# EAGLE design hvreg_feedback_3PS_ACDC (EAGLE 7.2.0)
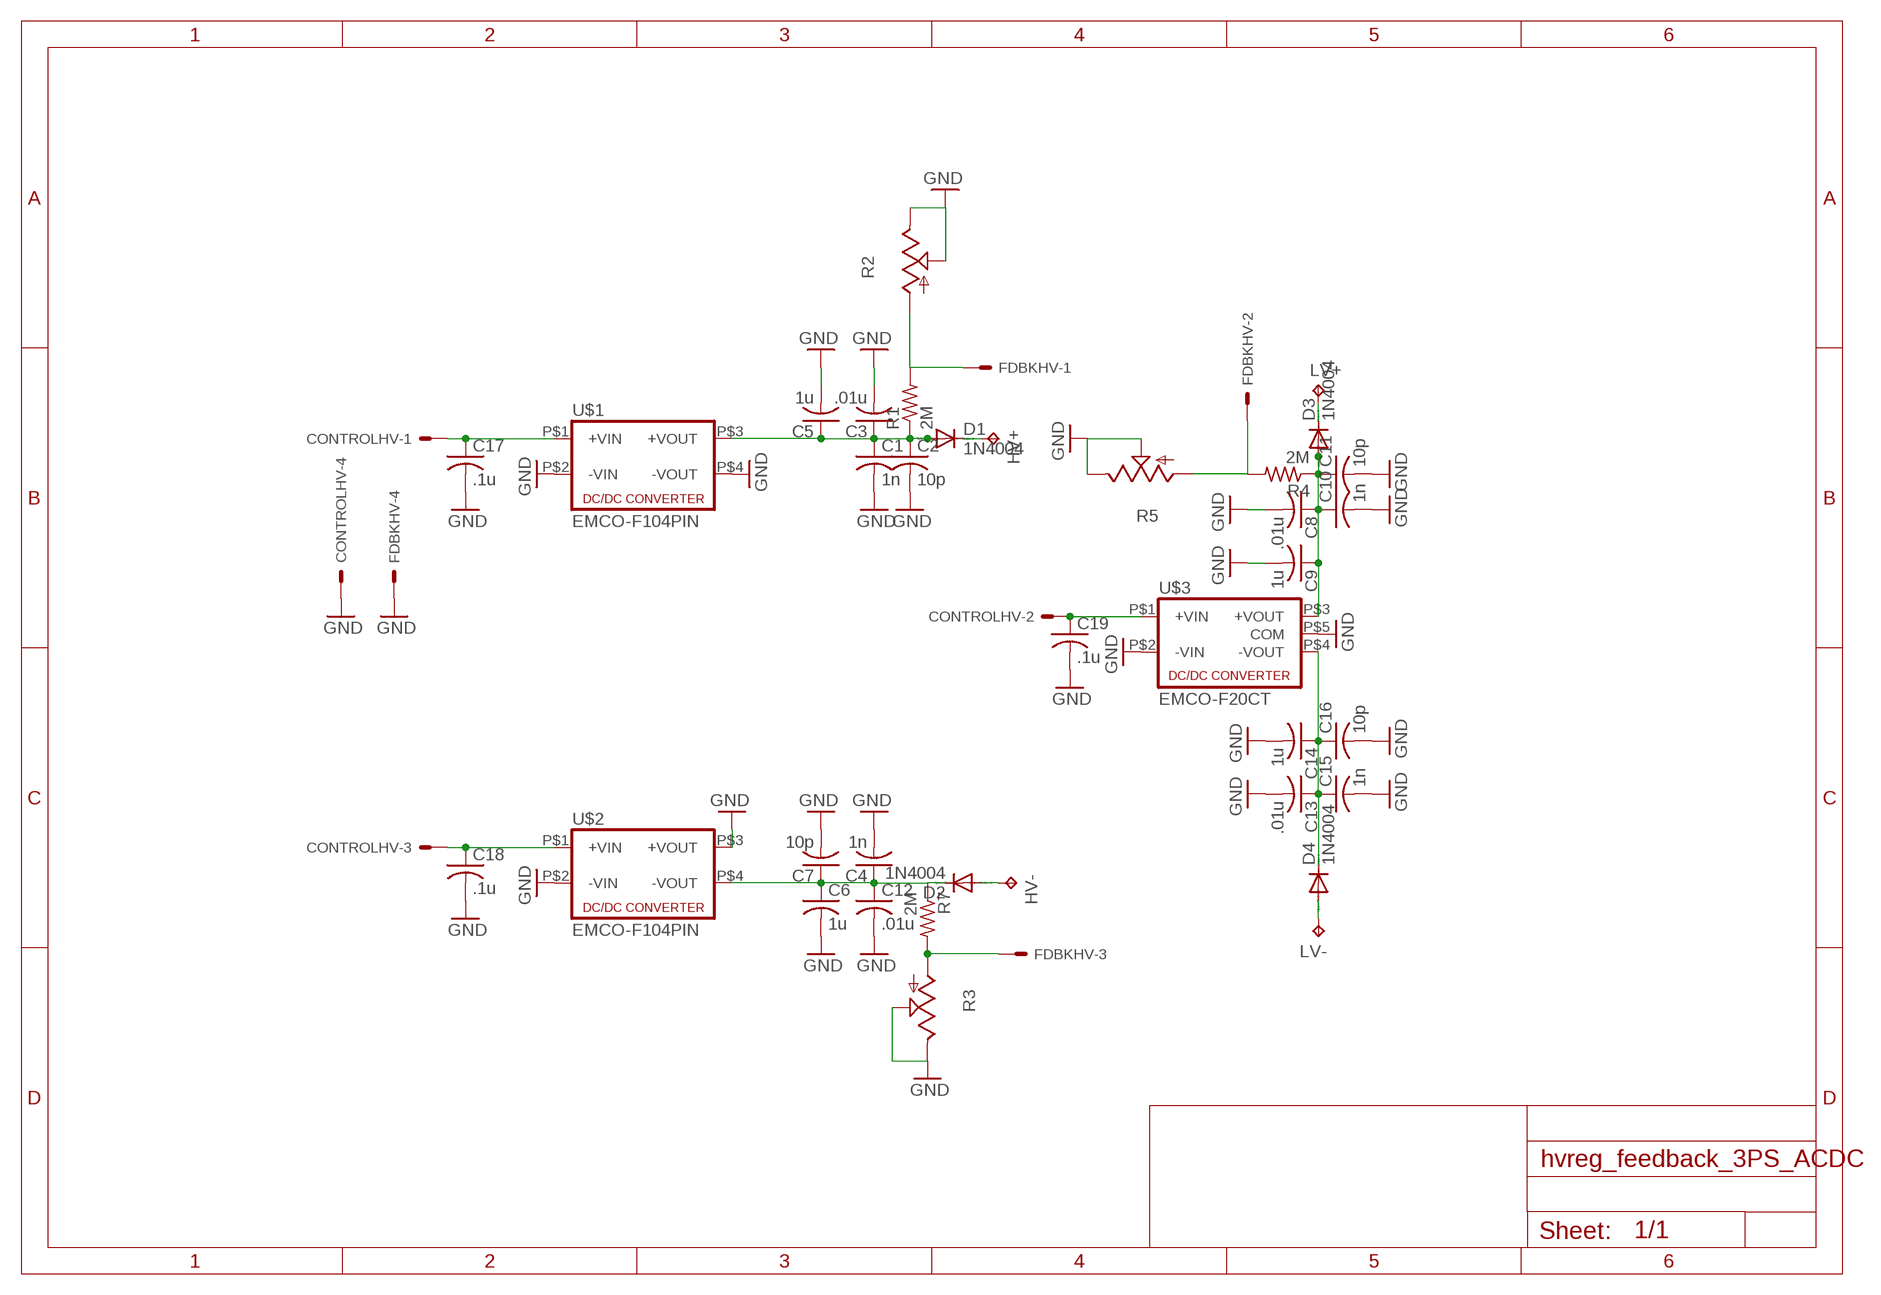
[diagram p0: schematic, sheet 1]

## Parts
C1  1n  C-US102-043X133  [C102-043X133]
C2  10p  C-US102-043X133  [C102-043X133]
C3  .01u  C-US102-043X133  [C102-043X133]
C4  1n  C-US102-043X133  [C102-043X133]
C5  1u  C-US275-205X316  [C275-205X316]
C6  1u  C-US275-205X316  [C275-205X316]
C7  10p  C-US102-043X133  [C102-043X133]
C8  .01u  C-US102-043X133  [C102-043X133]
C9  1u  C-US275-205X316  [C275-205X316]
C10  1n  C-US102-043X133  [C102-043X133]
C11  10p  C-US102-043X133  [C102-043X133]
C12  .01u  C-US102-043X133  [C102-043X133]
C13  .01u  C-US102-043X133  [C102-043X133]
C14  1u  C-US275-205X316  [C275-205X316]
C15  1n  C-US102-043X133  [C102-043X133]
C16  10p  C-US102-043X133  [C102-043X133]
C17  .1u  C-US102-043X133  [C102-043X133]
C18  .1u  C-US102-043X133  [C102-043X133]
C19  .1u  C-US102-043X133  [C102-043X133]
CONTROLHV  KK-156-4  [KK-156-4]
D1  1N4004  [DO41-10]
D2  1N4004  [DO41-10]
D3  1N4004  [DO41-10]
D4  1N4004  [DO41-10]
FDBKHV  KK-156-4  [KK-156-4]
HV+  TPPAD1-20Y  [P1-20Y]
HV-  TPPAD1-20Y  [P1-20Y]
LV+  TPPAD1-20Y  [P1-20Y]
LV-  TPPAD1-20Y  [P1-20Y]
R1  2M  R-US_0613/15  [P0613/15]
R2  TRIM_US-B90P  [SP19L]
R3  TRIM_US-B90P  [SP19L]
R4  2M  R-US_0613/15  [P0613/15]
R5  TRIM_US-B90P  [SP19L]
R7  2M  R-US_0613/15  [P0613/15]
U$1  EMCO-F104PIN  [EMCO-F]
U$2  EMCO-F104PIN  [EMCO-F]
U$3  EMCO-F20CT  [EMCO-F*CT]

## Nets
GND: C1.2 C2.2 C3.2 C4.2 C5.2 C6.2 C7.2 C8.2 C9.2 C10.2 C11.2 C12.2 C13.2 C14.2 C15.2 C16.2 C17.2 C18.2 C19.2 CONTROLHV.4 FDBKHV.4 R2.E R2.S R3.E R3.S R5.E R5.S U$1.P$2(-VIN) U$1.P$4(-VOUT) U$2.P$2(-VIN) U$2.P$3(+VOUT) U$3.P$2(-VIN) U$3.P$5(COM)
N$1: C1.1 C2.1 C3.1 C5.1 D1.A R1.1 U$1.P$3(+VOUT)
N$2: C4.1 C6.1 C7.1 C12.1 D2.C R7.1 U$2.P$4(-VOUT)
N$3: FDBKHV.1 R1.2 R2.A
N$4: D2.A HV-.TP
N$5: C8.1 C9.1 C10.1 C11.1 D3.A R4.1 U$3.P$3(+VOUT)
N$6: D1.C HV+.TP
N$7: FDBKHV.2 R4.2 R5.A
N$8: FDBKHV.3 R3.A R7.2
N$9: D3.C LV+.TP
N$10: C13.1 C14.1 C15.1 C16.1 D4.C U$3.P$4(-VOUT)
N$12: D4.A LV-.TP
N$13: C17.1 CONTROLHV.1 U$1.P$1(+VIN)
N$14: C19.1 CONTROLHV.2 U$3.P$1(+VIN)
N$15: C18.1 CONTROLHV.3 U$2.P$1(+VIN)

## Library data of the parts
C1-C19 = rcl:C-US: CAPACITOR, American symbol
CONTROLHV FDBKHV = con-molex:KK-156-4: KK 156 HEADER Source: http://www.molex.com/pdm_docs/sd/026604100_sd.pdf; OC_FARNELL: unknown; OC_NEWARK: unknown
D1-D4 = diode:1N4004: DIODE general purpose rectifier, 1 A
HV+ HV- LV+ LV- = testpad:TP: Test pad
R1 R4 R7 = resistor:R-US_: RESISTOR, American symbol
R2 R3 R5 = pot:TRIM_US-: POTENTIOMETER
U$1 U$2 = dc-dc-converter:EMCO-F10
U$3 = dc-dc-converter:EMCO-F20CT

## Board
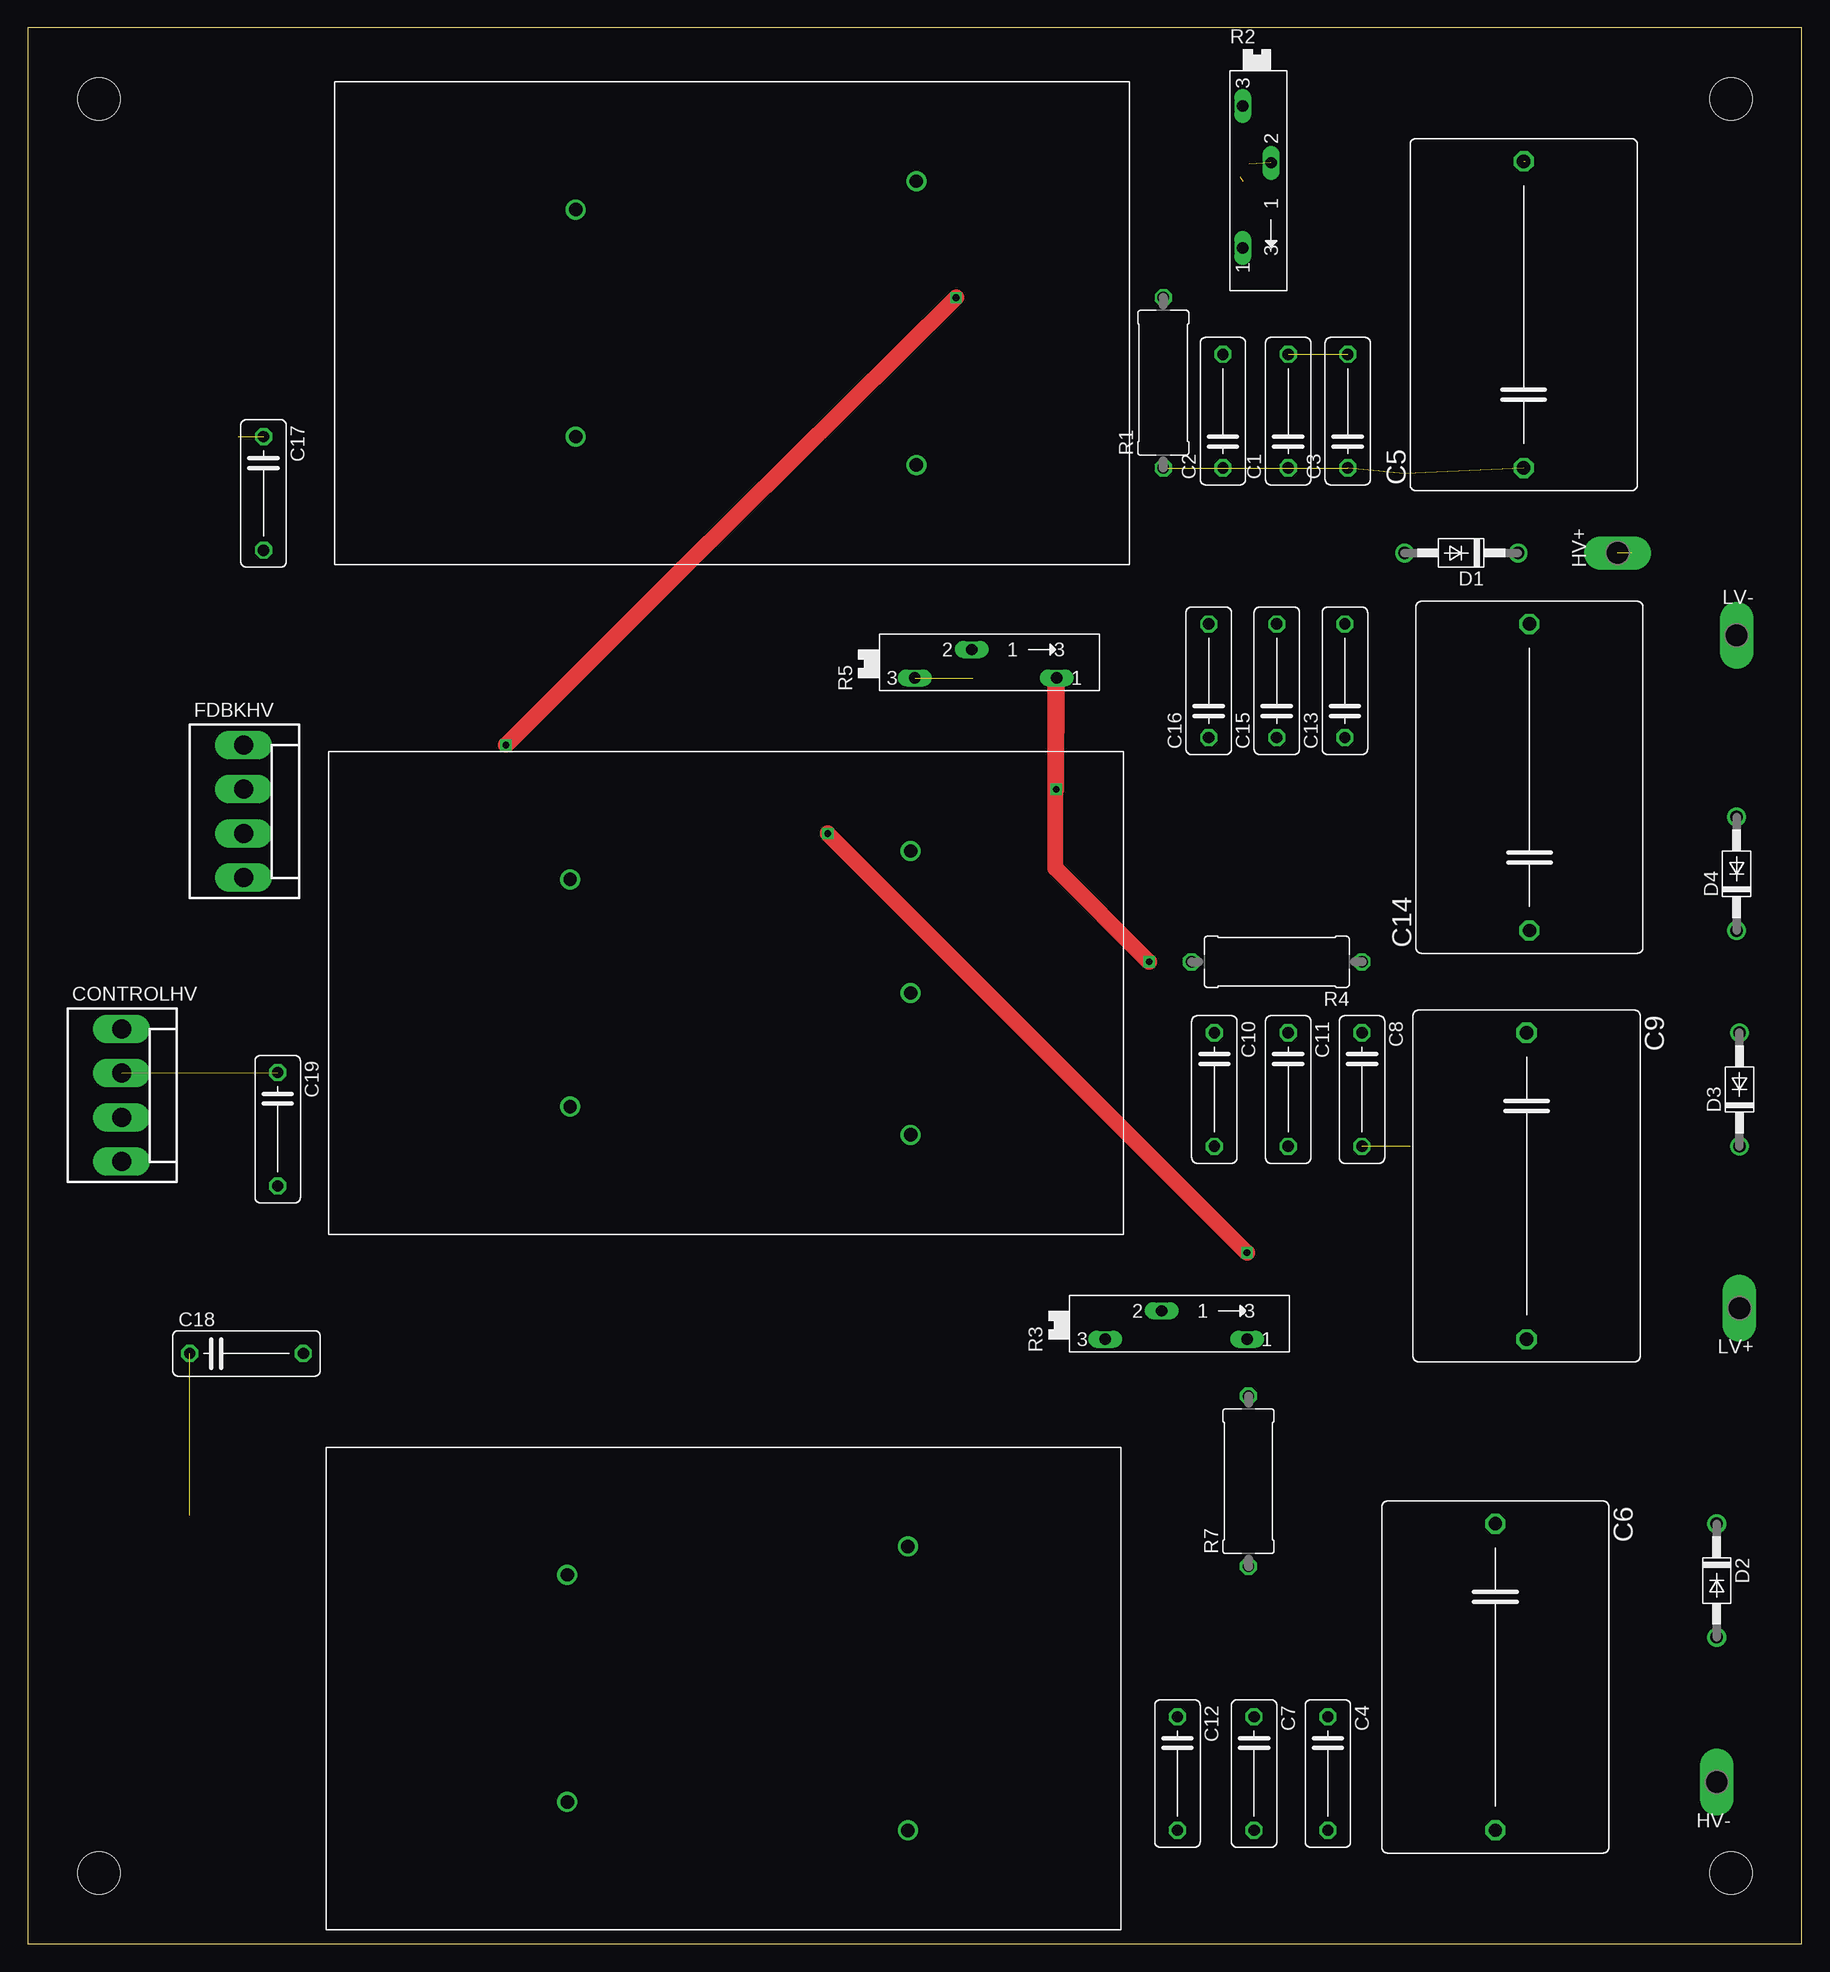
[diagram p1: board, top side]
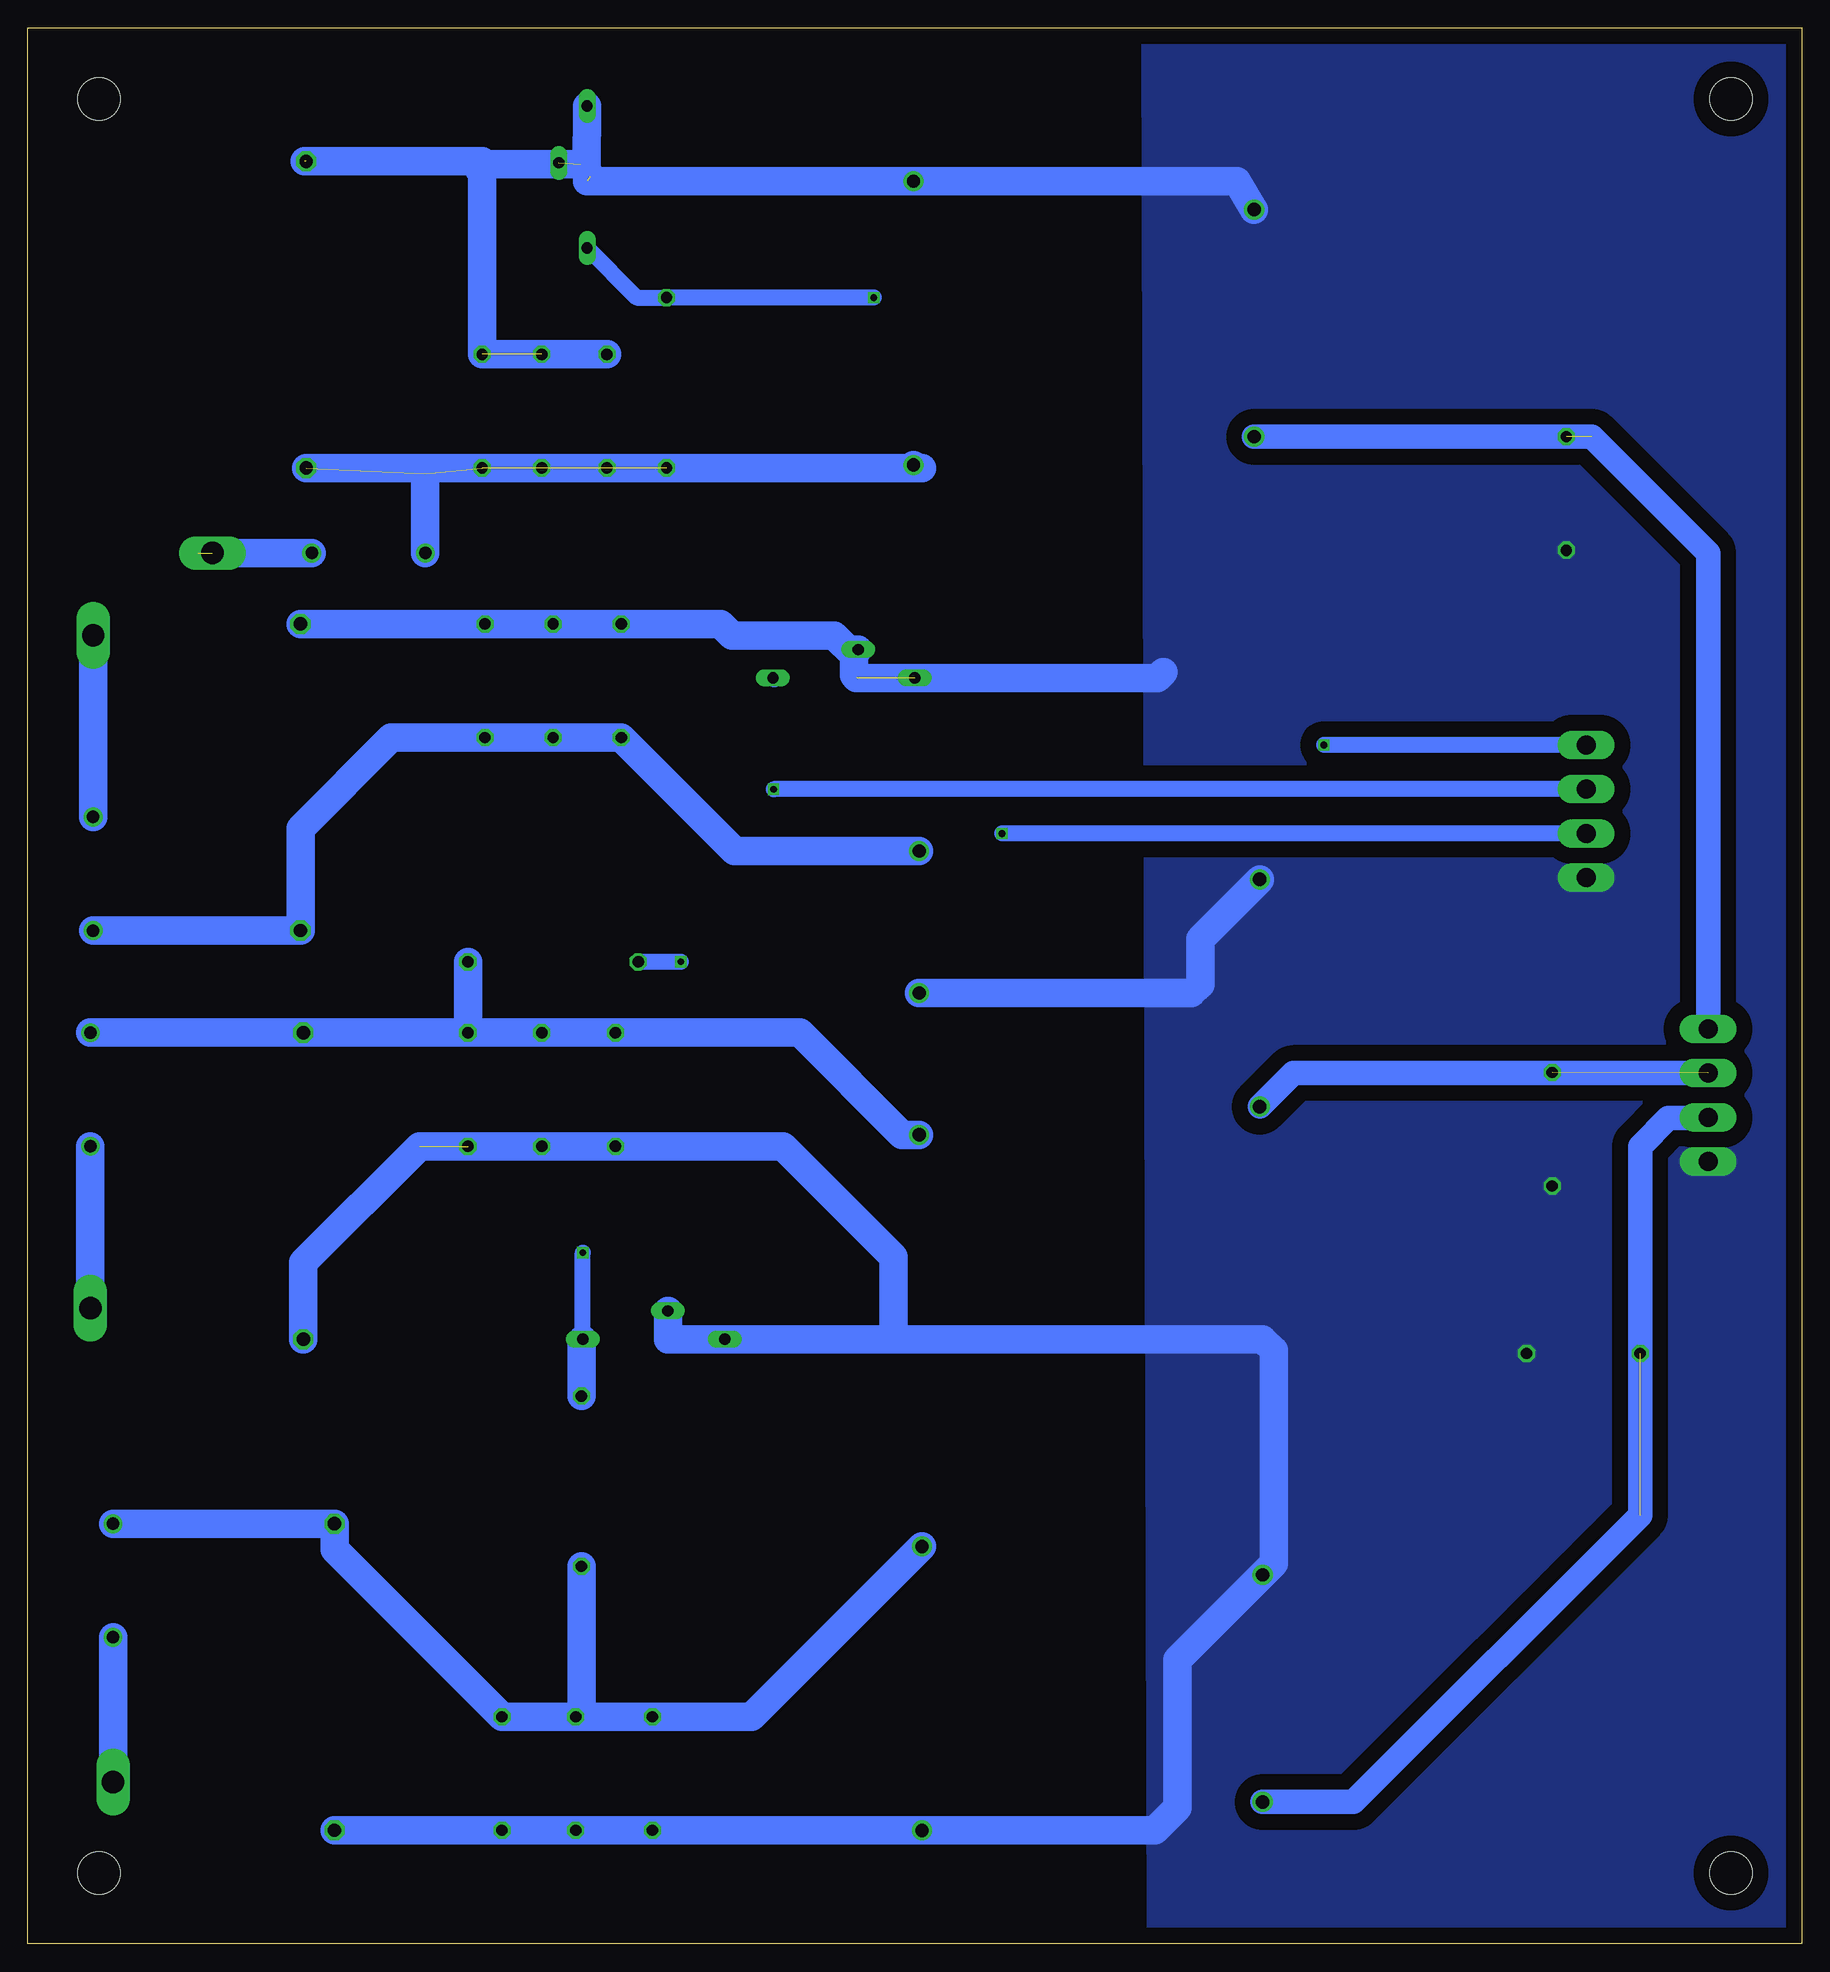
[diagram p2: board, bottom side, seen from below]

Size 158.75 x 171.45 mm. Coordinates in mm from the lower left corner, seen from the top.
Outline: 0,0 158.75,0 158.75,171.45 0,171.45 0,0
Copper layers (1*16): Top 0.035mm / dielectric 1.5mm / Bottom 0.035mm
Design rules "default": minimum track width 10mil, minimum drill 24mil, track to track 8mil, track to pad 8mil, pad to pad 8mil, via to via 8mil, smd to smd 8mil, copper to edge 40mil, drill to drill 8mil, minimum pad ring 10mil, minimum via ring 8mil, stop-mask expansion 4mil, vias tented up to drill 0mil, thermal gap 10mil
Holes 3.8 mm at 152.4,6.35 152.4,165.1 6.35,6.35 6.35,165.1

### Footprints (pad centres in the part's own frame; a part is rotated, then mirrored left to right if it is on the bottom)
C102-043X133 = drill 1.016 octagon: 1 -5.08,0; 2 5.08,0
C275-205X316 = drill 1.194 octagon: 1 -13.716,0; 2 13.716,0
KK-156-4 = drill 1.7 pad 2.184 long: 1 -5.94,0; 2 -1.98,0; 3 1.98,0; 4 5.94,0
DO41-10 = drill 1.118: A 5.08,0; C -5.08,0
P1-20Y = drill 2.007 pad 2.54 long: TP 0,0
P0613/15 = drill 1.016 octagon: 1 -7.62,0; 2 7.62,0
SP19L = drill 1.016 long: A 5.715,-1.27; E -6.985,-1.27; S -1.905,1.27
EMCO-F = drill 1.2: P$1 0,0; P$2 0,20.32; P$3 30.48,-2.54; P$4 30.48,22.86
EMCO-F*CT = drill 1.2: P$1 0,0; P$2 0,20.32; P$3 30.48,-2.54; P$4 30.48,22.86; P$5 30.48,10.16

### Placement (x,y rotation side)
C1  112.78,137.16 90 top
C2  106.93,137.16 90 top
C3  118.11,137.16 90 top
C4  116.33,15.24 270 top
C5  133.86,145.8 90 top
C6  131.32,23.88 270 top
C7  109.73,15.24 270 top
C8  119.38,76.45 270 top
C9  134.11,67.82 270 top
C10  106.17,76.45 270 top
C11  112.78,76.45 270 top
C12  102.87,15.24 270 top
C13  117.86,113.03 90 top
C14  134.37,104.39 90 top
C15  111.76,113.03 90 top
C16  105.66,113.03 90 top
C17  21.08,129.79 270 top
C18  19.56,52.83 0 top
C19  22.35,72.9 270 top
CONTROLHV  8.38,75.95 270 top
D1  128.27,124.46 180 top
D2  151.13,32.51 270 top
D3  153.16,76.45 90 top
D4  152.91,95.76 90 top
FDBKHV  19.3,101.35 270 top
HV+  142.24,124.46 90 top
HV-  151.13,14.48 180 top
LV+  153.16,56.9 180 top
LV-  152.91,117.09 0 top
R1  101.6,139.7 90 top
R2  109.98,157.48 270 top
R3  103.38,55.37 0 top
R4  111.76,87.88 180 top
R5  86.36,114.55 0 top
R7  109.22,41.4 90 top
U$1  49.02,134.87 0 top
U$2  48.26,12.7 0 top
U$3  48.51,74.93 0 top

### Tracks (layer width: path | path; a pad name or v marks a point on that pad's centre or on a via)
GND  (6 unrouted)
  Bottom 2.54: U$1.P$2 50.55,157.73 U$1.P$4 108.71,157.73 | 118.11,159 C3.2 C2.2 | 133.99,159.51 118.11,159.51 118.11,159.26 | 108.46,158.12 108.76,159.02 | 108.76,159.02 R2.E | 118.11,159.26 118.11,159 | 118.11,159 118.36,158.75 118.36,159 118.11,159.26 | 118.11,159.26 109.28,159.26 108.76,159.02 | U$3.P$5 54.61,85.09 53.85,85.85 53.85,89.92 U$3.P$2 | C6.2 C4.2 C7.2 C12.2 U$2.P$3 57.91,10.16 55.88,12.19 55.88,25.4 U$2.P$2 47.24,34.04 47.24,53.09 48.26,54.1 81.28,54.1 | R3.S 101.47,54.1 R3.E 81.28,54.1 | 84.84,115.32 84.84,113.54 84.58,113.28 57.66,113.28 57.15,113.79 | 84.84,115.32 84.84,115.44 R5.S | 84.84,115.32 86.61,117.09 95.76,117.09 96.77,118.11 C16.2 C15.2 C13.2 C14.2 | C9.2 134.11,60.96 123.7,71.37 C11.2 C10.2 91.19,71.37 81.28,61.47 81.28,54.1
  pour Bottom (isolate 1.422, no thermals): 0,171.45 58.93,171.2 58.42,0.25 0.25,0
N$1  (5 unrouted)
  Bottom 2.54: C5.1 78.74,132.08 U$1.P$3 | D1.A 123.19,131.57
N$2
  Bottom 2.54: D2.C C6.1 131.32,35.31 C4.1 C7.1 109.22,20.32 | 109.22,20.32 C12.1 93.98,20.32 U$2.P$4 | R7.1 109.22,20.32
N$3  (via drill 0.6)
  Top 1.422: v83.06,147.32 58.57,123.09 v42.77,107.29
  Bottom 1.422: v83.06,147.32 R1.2 104.27,147.32 R2.A | FDBKHV.1 v42.77,107.29
N$4
  Bottom 2.54: HV-.TP D2.A
N$5
  Bottom 2.54: D3.A C9.1 C8.1 | U$3.P$3 80.52,72.39 89.66,81.53 C10.1 C11.1 C8.1 | C8.1 R4.1
N$6  (1 unrouted)
  Bottom 2.54: D1.C 143.51,124.46
N$7  (via drill 0.6)
  Top 1.422: v92.02,103.33 R5.A | v91.95,113.16 91.95,96.27 v100.33,87.88
  Bottom 1.422: FDBKHV.2 v92.02,103.33 | v91.95,113.16 R5.A | v100.33,87.88 R4.2
N$8  (via drill 0.6)
  Top 1.422: v109.09,61.85 v71.58,99.37
  Bottom 1.422: FDBKHV.3 v71.58,99.37 | R3.A v109.09,61.85
  Bottom 2.54: R7.2 109.22,53.98 R3.A
N$9
  Bottom 2.54: D3.C LV+.TP
N$10
  Bottom 2.54: D4.C C14.1 134.37,99.82 126.24,107.95 C13.1 C15.1 C16.1 95.5,97.79 U$3.P$4
N$12
  Bottom 2.54: D4.A LV-.TP
N$13  (1 unrouted)
  Bottom 2.184: CONTROLHV.1 8.38,124.46 18.8,134.87 U$1.P$1
N$14  (1 unrouted)
  Bottom 2.184: CONTROLHV.2 45.52,77.93 U$3.P$1
N$15  (1 unrouted)
  Bottom 2.184: U$2.P$1 40.13,12.7 14.48,38.35 14.48,71.37 11.94,73.91 8.43,73.91 CONTROLHV.3